# Altium project OCP_V1.0.PrjPcb
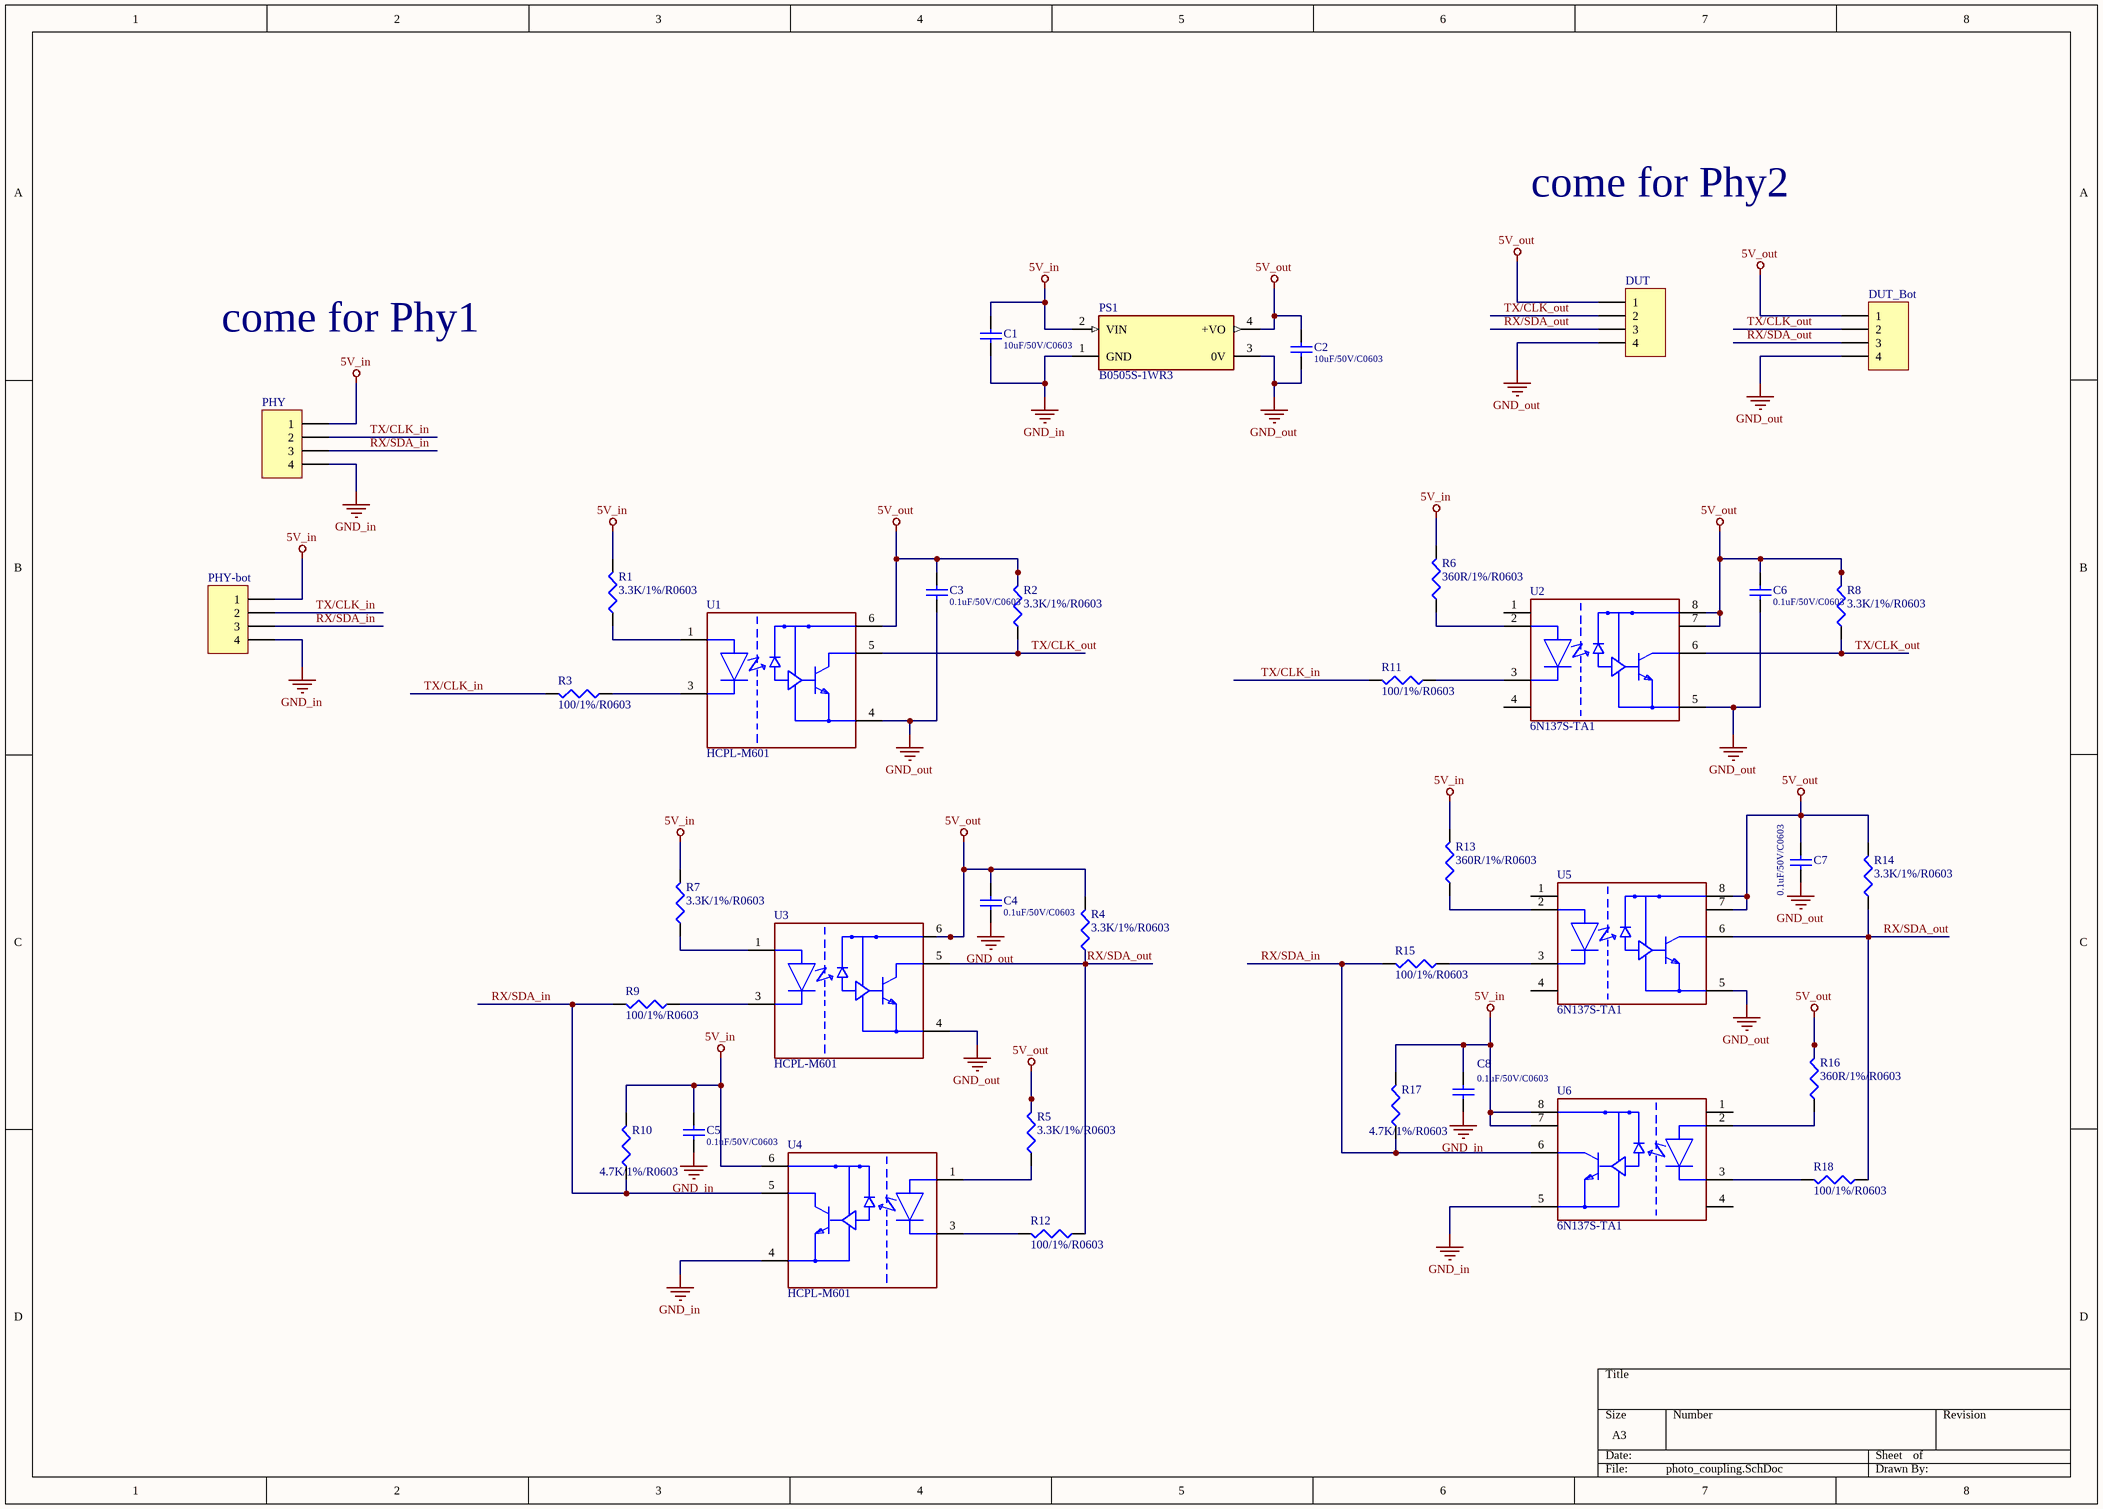
[diagram p0: photo_coupling.SchDoc]
1 sheet, 37 parts. Net scope: global (net labels, ports and power ports of the same name join across sheets).
Board file: OCP_V1.0.PcbDoc

## Sheet photo_coupling.SchDoc
size A3; SheetNumber: 1; SheetTotal: 1

### Parts
C1  value 10uF/50V/C0603  [C0603]  (hidden comment: 0.1uF/50V/C0603)
C2  value 10uF/50V/C0603  [C0603]  (hidden comment: 0.1uF/50V/C0603)
C3  0.1uF/50V/C0603  [C0603]
C4  0.1uF/50V/C0603  [C0603]
C5  0.1uF/50V/C0603  [C0603]
C6  0.1uF/50V/C0603  [C0603]
C7  0.1uF/50V/C0603  [C0603]
C8  0.1uF/50V/C0603  [C0603]
DUT  CCX-W125-04-SMT  [CON1.25MM_4PIN(180)]  (value not drawn)
DUT_Bot  CCX-W125-04-SMT  [CON1.25MM_4PIN(180)]  (value not drawn)
PHY  CCX-W125-04-SMT  [CON1.25MM_4PIN(180)]  (value not drawn)
PHY-bot  CCX-W125-04-SMT  [CON1.25MM_4PIN(180)]  (value not drawn)
PS1  B0505S-1WR3  [CONV_B0505S-1WR3]
R1  3.3K/1%/R0603  [R0603]
R2  3.3K/1%/R0603  [R0603]
R3  value 100/1%/R0603  [R0603]  (hidden comment: 3.3K/1%/R0603)
R4  3.3K/1%/R0603  [R0603]
R5  3.3K/1%/R0603  [R0603]
R6  value 360R/1%/R0603  [R0603]  (hidden comment: 3.3K/1%/R0603)
R7  3.3K/1%/R0603  [R0603]
R8  3.3K/1%/R0603  [R0603]
R9  value 100/1%/R0603  [R0603]  (hidden comment: 3.3K/1%/R0603)
R10  value 4.7K/1%/R0603  [R0603]  (hidden comment: 3.3K/1%/R0603)
R11  value 100/1%/R0603  [R0603]  (hidden comment: 3.3K/1%/R0603)
R12  value 100/1%/R0603  [R0603]  (hidden comment: 3.3K/1%/R0603)
R13  value 360R/1%/R0603  [R0603]  (hidden comment: 3.3K/1%/R0603)
R14  3.3K/1%/R0603  [R0603]
R15  value 100/1%/R0603  [R0603]  (hidden comment: 3.3K/1%/R0603)
R16  value 360R/1%/R0603  [R0603]  (hidden comment: 3.3K/1%/R0603)
R17  value 4.7K/1%/R0603  [R0603]  (hidden comment: 3.3K/1%/R0603)
R18  value 100/1%/R0603  [R0603]  (hidden comment: 3.3K/1%/R0603)
U1  HCPL-M601  [JEDEC_MO-155]
U2  6N137S-TA1  [SOP254P1016X460-8N]
U3  HCPL-M601  [JEDEC_MO-155]
U4  HCPL-M601  [JEDEC_MO-155]
U5  6N137S-TA1  [SOP254P1016X460-8N]
U6  6N137S-TA1  [SOP254P1016X460-8N]

### Nets
5V_in: C1.2 C5.2 C8.2 PHY.1 PHY-bot.1 PS1.2(VIN) R1.2 R6.2 R7.2 R10.2 R13.2 R17.2 U4.6(VCC) U6.7(VE) U6.8(VCC)
5V_out: C2.2 C3.2 C4.2 C6.2 C7.2 DUT.1 DUT_Bot.1 PS1.4(+VO) R2.2 R4.2 R5.2 R8.2 R14.2 R16.2 U1.6(VCC) U2.7(VE) U2.8(VCC) U3.6(VCC) U5.7(VE) U5.8(VCC)
GND_in: C1.1 C5.1 C8.1 PHY.4 PHY-bot.4 PS1.1(GND) U4.4(GND) U6.5(GND)
GND_out: C2.1 C3.1 C4.1 C6.1 C7.1 DUT.4 DUT_Bot.4 PS1.3(0V) U1.4(GND) U2.5(GND) U3.4(GND) U5.5(GND)
RX/SDA_in: PHY.3 PHY-bot.3 R9.2 R10.1 R15.2 R17.1 U4.5(V01) U6.6(V01)
RX/SDA_out: DUT.3 DUT_Bot.3 R4.1 R12.1 R14.1 R18.1 U3.5(V01) U5.6(V01)
TX/CLK_in: PHY.2 PHY-bot.2 R3.2 R11.2
TX/CLK_out: DUT.2 DUT_Bot.2 R2.1 R8.1 U1.5(V01) U2.6(V01)
NetR1_1: R1.1 U1.1(VF1+)
NetR3_1: R3.1 U1.3(VF1-)
NetR5_1: R5.1 U4.1(VF1+)
NetR6_1: R6.1 U2.2(VF1+)
NetR7_1: R7.1 U3.1(VF1+)
NetR9_1: R9.1 U3.3(VF1-)
NetR11_1: R11.1 U2.3(VF1-)
NetR12_2: R12.2 U4.3(VF1-)
NetR13_1: R13.1 U5.2(VF1+)
NetR15_1: R15.1 U5.3(VF1-)
NetR16_1: R16.1 U6.2(VF1+)
NetR18_2: R18.2 U6.3(VF1-)

Not connected (* = marked no-connect by the designer): U2 1(NC) 4(NC); U5 1(NC) 4(NC); U6 1(NC) 4(NC)

### Notes on the sheet
- come for Phy2
- come for Phy1

### Library data of the parts
C1-C8 = C0603 0.1uF 100V: MLCC 0603 0.1uF 50V 10% X7R; ETIPN1: ME2C1-30104K7-00; No: 01 MLCC; ETIPN1_Des: MLCC 0603 0.1uF 50V 10% X7R
  C3-C8: Value: 0.1uF/50V/C0603
DUT DUT_Bot PHY PHY-bot = Pitch 1.25 mm/ 180° / 4 pin: ETIPN1: MM203-04022-0006; Value: CCX-W125-04-SMT; ETIPN1_Des: CCX-W125-04-SMT
PS1 = B0505S-1WR3: Isolated Module DC DC Converter 1 Output 5V - - - 200mA 4.5V - 5.5V Input; MF: Mornsun America, LLC; Value: *; MP: B0505S-1WR3; Price: None; Package: SIP-4-4 MORNSUN; Check_prices: https://www.snapeda.com/parts/B0505S-1WR3/MORNSUN/view-part/?ref=eda; Availability: In Stock; SnapEDA_Link: https://www.snapeda.com/parts/B0505S-1WR3/MORNSUN/view-part/?ref=snap; Purchase-URL: https://pricing.snapeda.com/search/part/B0505S-1WR3/?ref=eda
R1-R18 = R0603 3.3k 1% 1/10w: Res 0603 3.3K 1% 1/10w; ETIPN1: ME2R1-303K3F2-00; No: 02 Res; ETIPN1_Des: Res 0603 3.3K 1% 1/10w
  R1 R2 R4 R5 R7 R8 R14: Value: 3.3K/1%/R0603
U1 U3 U4 = HCPL-M601: Small Outline, 5 Lead, High CMR, / High Speed, Logic Gate Optocouplers
U2 U5 U6 = 6N137S-TA1: Small Outline, 8 Lead, High CMR, / High Speed, Logic Gate Optocouplers